# Altium schematic sheet ref.SchDoc
size A4; SheetNumber: 5; SheetTotal: 6
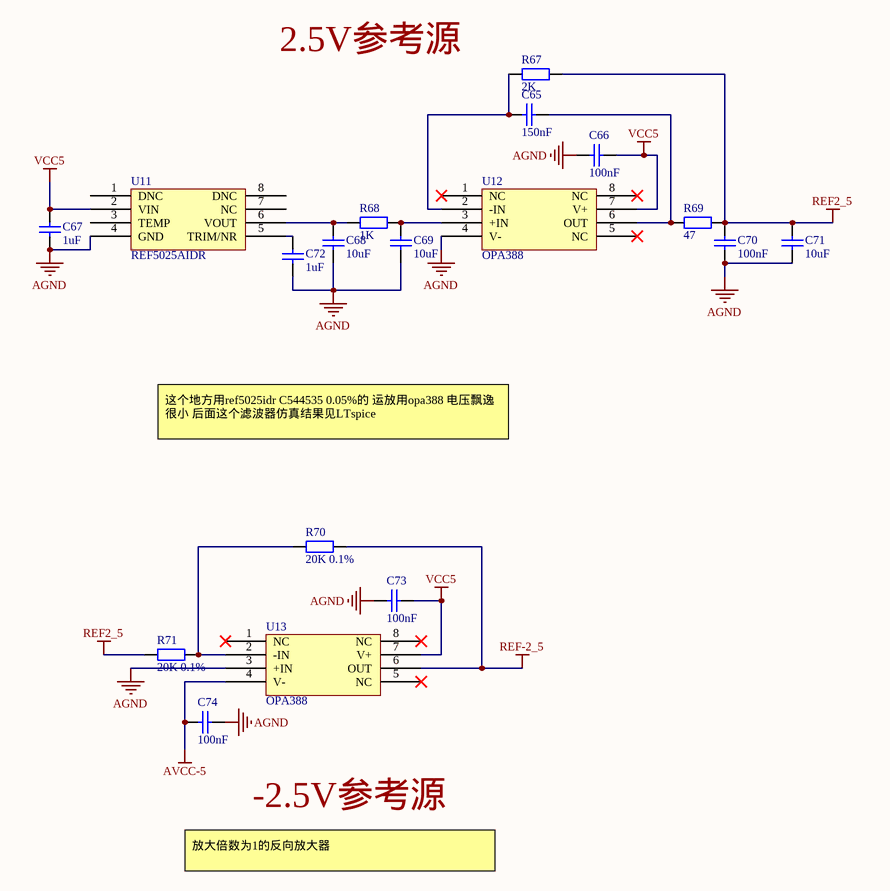
[diagram p0: ref.SchDoc]

## Parts
C65  150nF  [C0603_L]
C66  100nF  [C0603_L]
C67  1uF  [C0603_L]
C68  10uF  [C0603_L]
C69  10uF  [C0603_L]
C70  100nF  [C0603_L]
C71  10uF  [C0603_L]
C72  1uF  [C0603_L]
C73  100nF  [C0603_L]
C74  100nF  [C0603_L]
R67  2K  [R0603_L]
R68  1K  [R0603_L]
R69  47  [R0603_L]
R70  20K 0.1%  [R0603_L]
R71  20K 0.1%  [R0603_L]
U11  REF5025AIDR  [SOIC-8]
U12  OPA388  [SOIC-8]
U13  OPA388  [SOIC-8]

## Nets
AGND: C66.2 C67.1 C68.1 C69.1 C70.2 C71.2 C72.1 C73.1 C74.1 U11.4(GND) U12.4(V-) U13.3(+IN)
AVCC-5: C74.2 U13.4(V-)
REF2_5: C70.1 C71.1 R67.2 R69.2 R71.1
REF-2_5: R70.2 U13.6(OUT)
VCC5: C66.1 C67.2 C73.2 U11.2(VIN) U12.7(V+) U13.7(V+)
NetC65_1: C65.1 R67.1 U12.2(-IN)
NetC65_2: C65.2 R69.1 U12.6(OUT)
NetC68_2: C68.2 R68.1 U11.6(VOUT)
NetC69_2: C69.2 R68.2 U12.3(+IN)
NetC72_2: C72.2 U11.5(TRIM/NR)
NetR70_1: R70.1 R71.2 U13.2(-IN)

Not connected (* = marked no-connect by the designer): U11 1(DNC) 3(TEMP) 7(NC) 8(DNC); U12 1(NC)* 5(NC)* 8(NC)*; U13 1(NC)* 5(NC)* 8(NC)*

## Notes on the sheet
- 2.5V参考源
- 这个地方用ref5025idr C544535 0.05%的 运放用opa388 电压飘逸很小 后面这个滤波器仿真结果见LTspice
- -2.5V参考源
- 放大倍数为1的反向放大器

## Library data of the parts
C65-C74 = C: 贴片电容/MLCC电容; BOM名称: 无极性贴片电容; 联系下单店铺卖家 免费帮你查找封装: 联系下单店铺卖家 免费技术指导
R67-R71 = R: 贴片电阻; 联系下单店铺卖家 免费帮你查找封装: 联系下单店铺卖家 免费技术指导; BOM名称: 贴片电阻
U11 = REF5025AIDR: 2.5V、3μVpp/V 噪声、3ppm/°C 温漂、精密串联电压基准; jlc_id: C544535
U12 U13 = OPA388: OPA388 单路、10MHz、CMOS、零温漂、零交叉、真 RRIO 精密运算放大器; jlc_id: C11341